# Altium schematic sheet SUPPORT.SchDoc: F2837x controlCARD
size 431 x 279 mm; Organization: Texas Instruments; Revision: 1.3
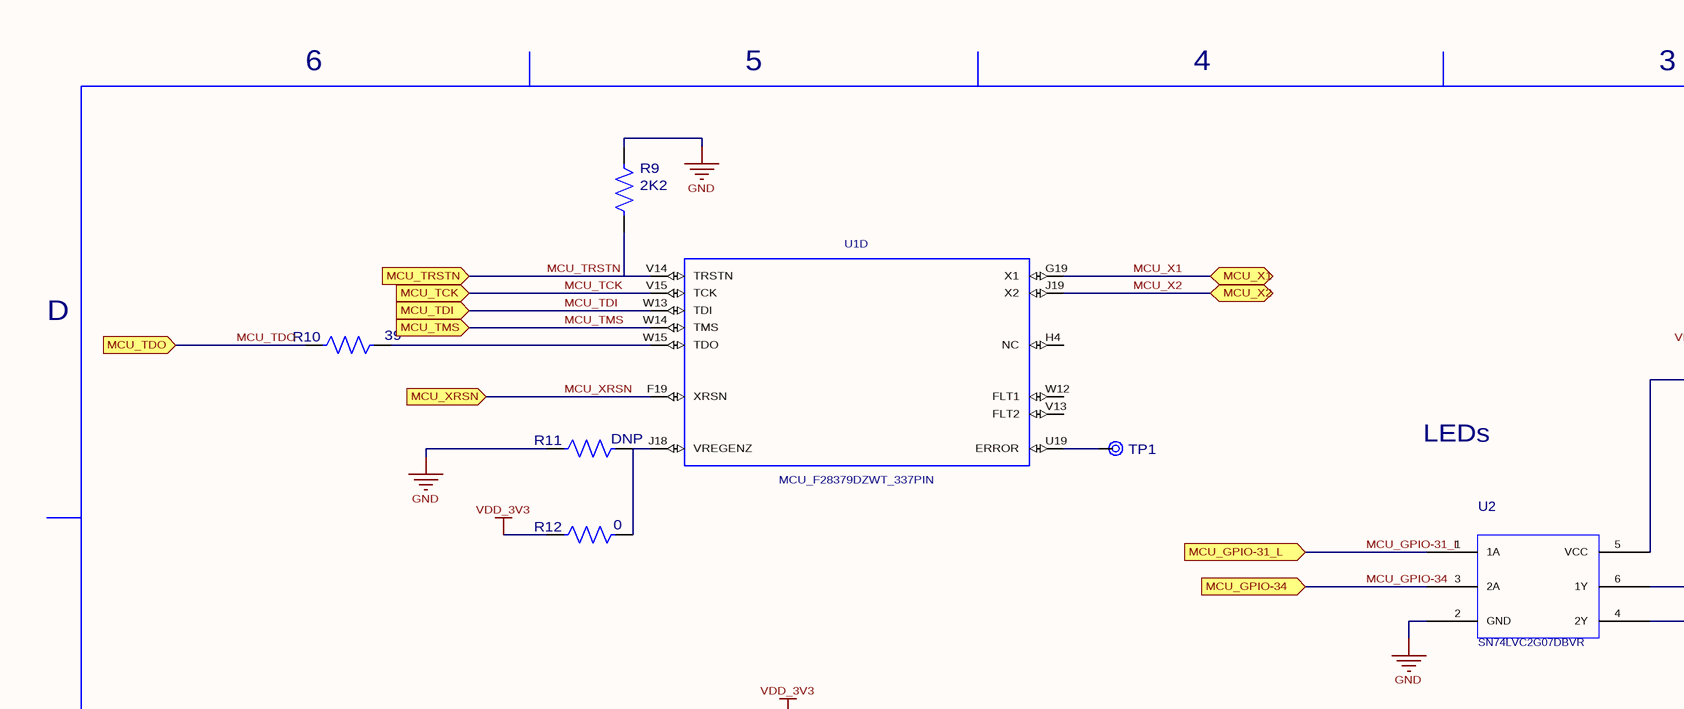
[diagram p0: SUPPORT.SchDoc, top left]
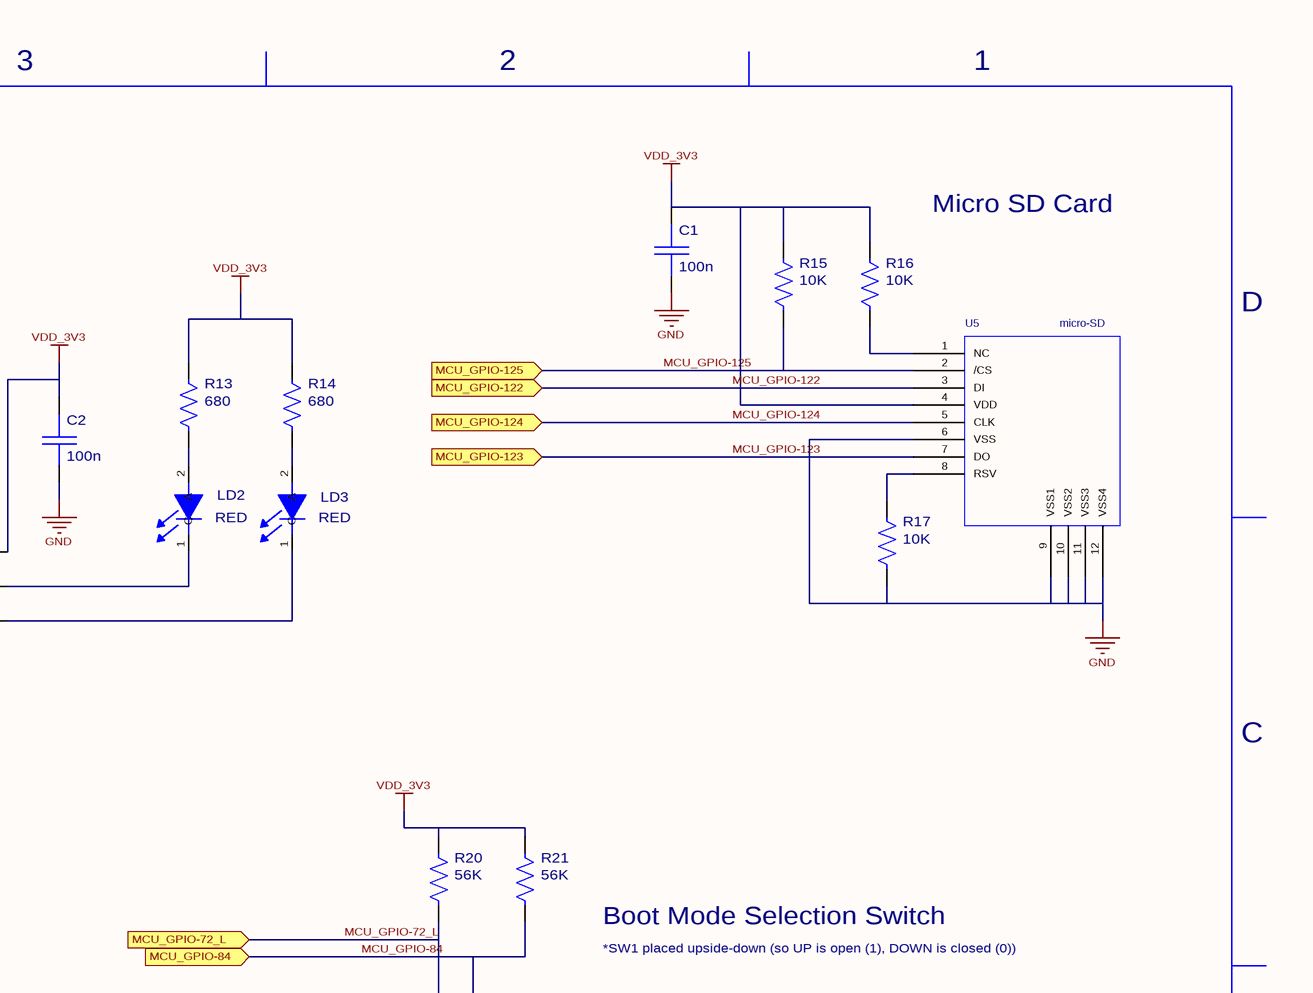
[diagram p1: SUPPORT.SchDoc, top right]
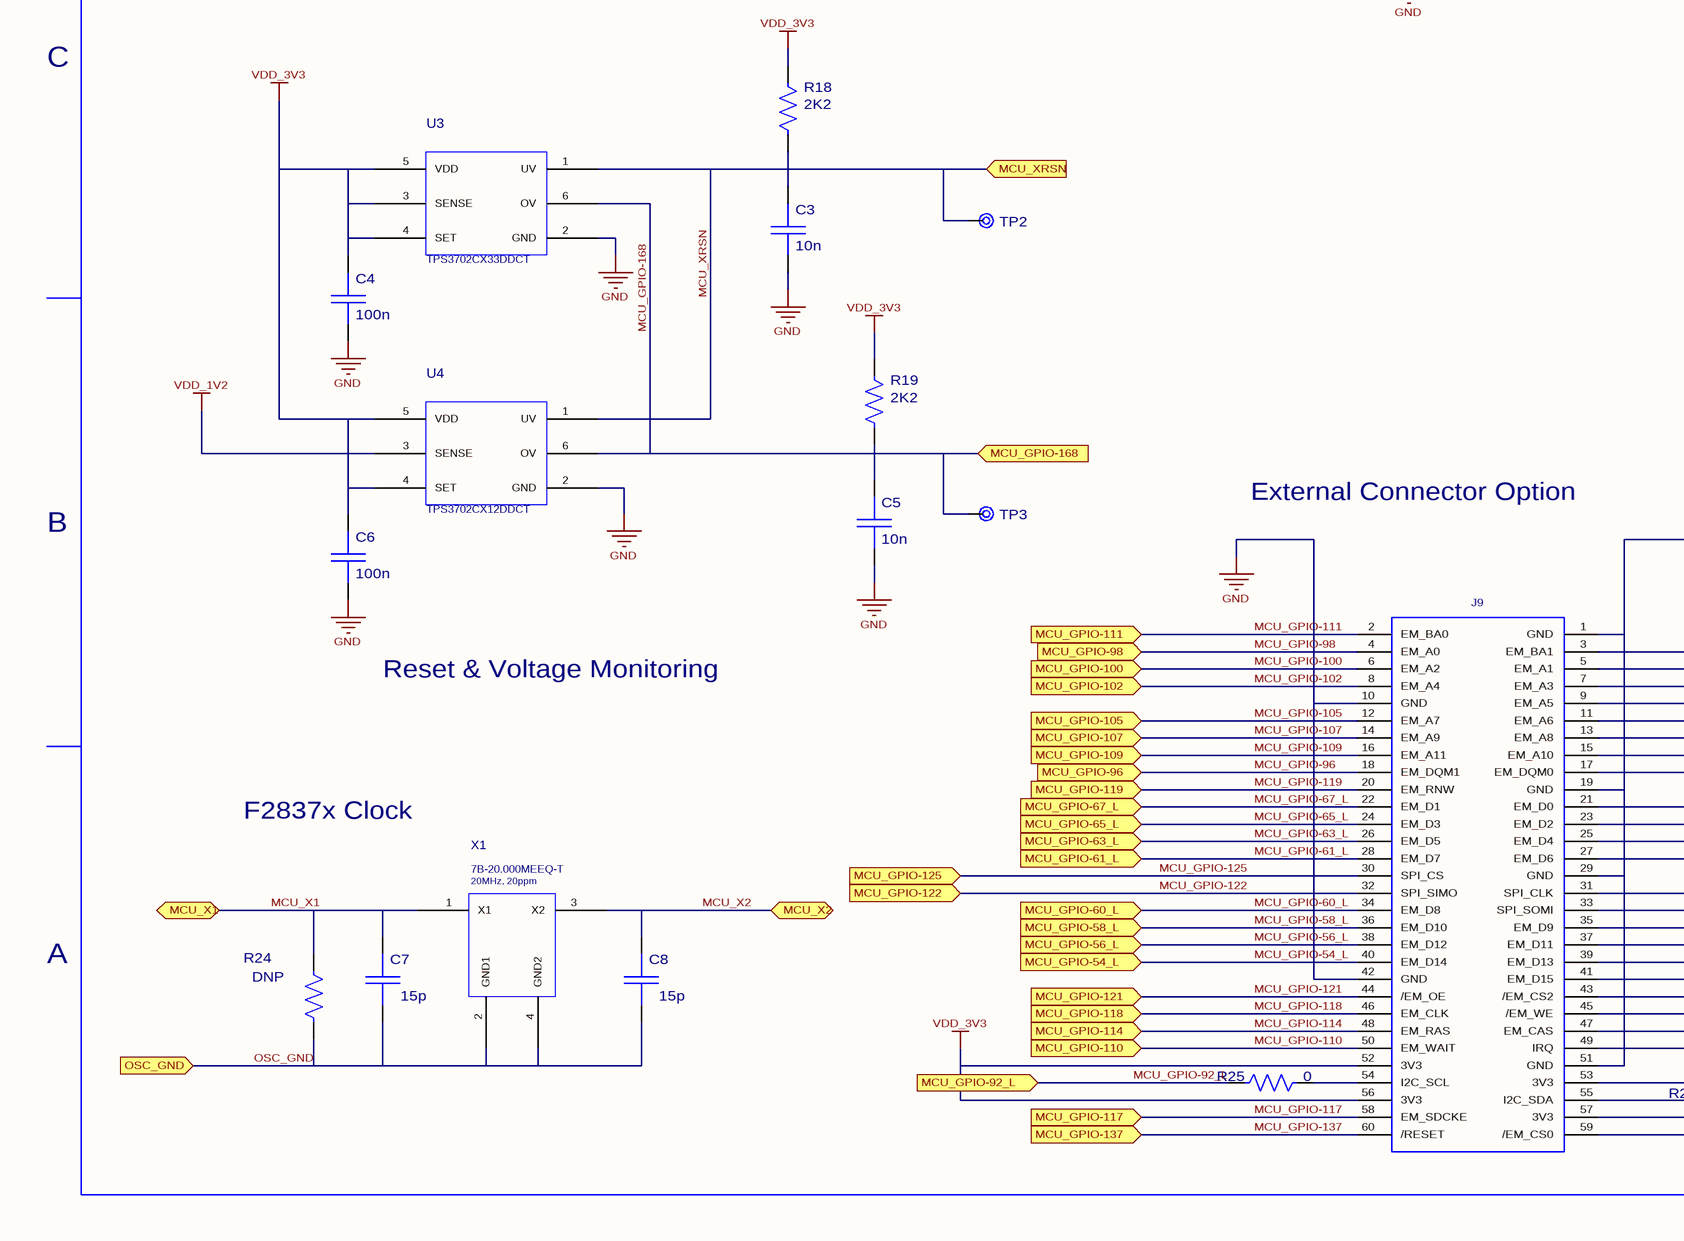
[diagram p2: SUPPORT.SchDoc, bottom left]
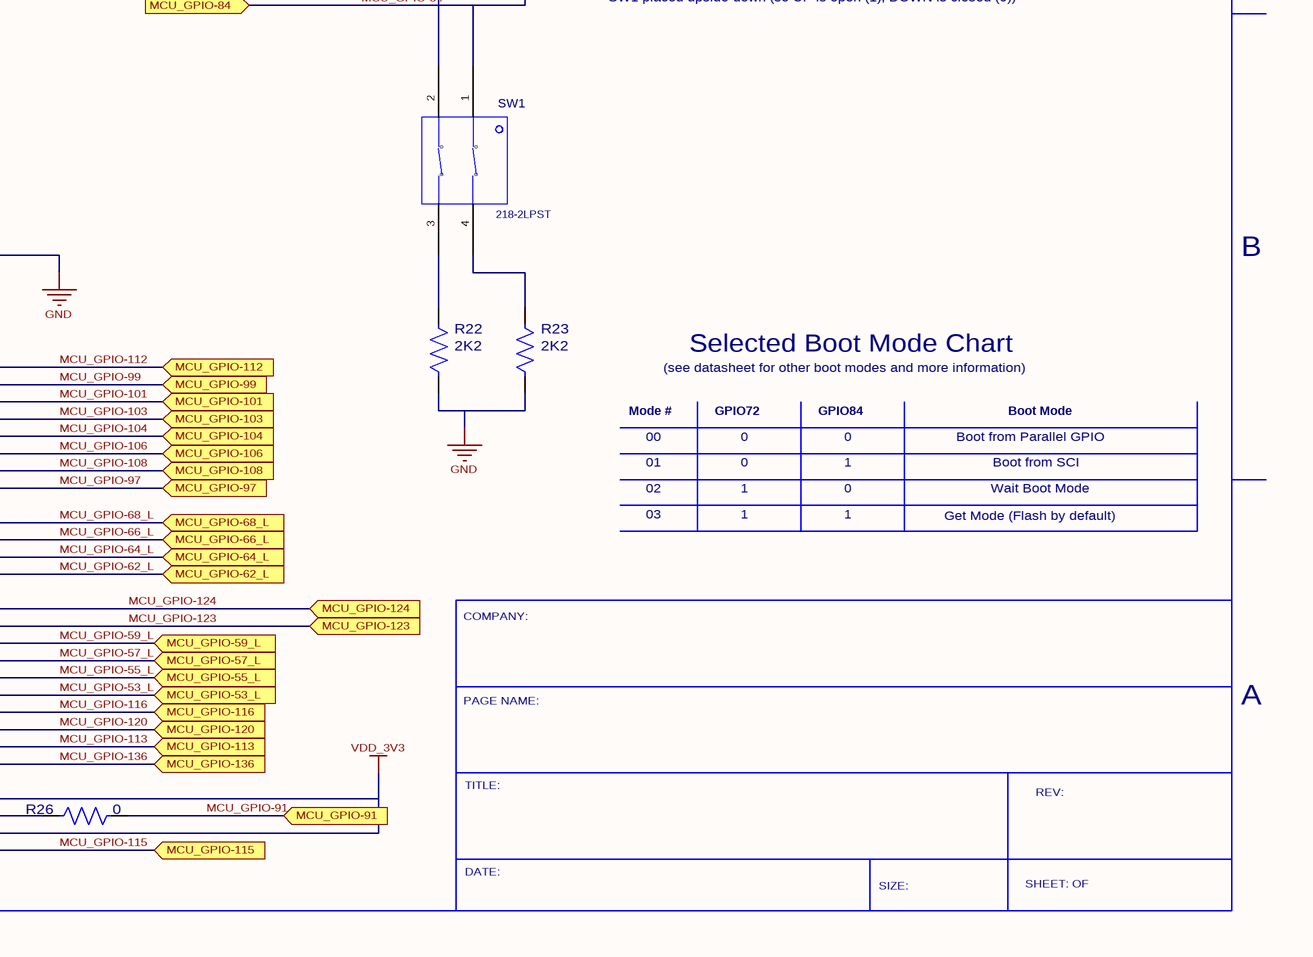
[diagram p3: SUPPORT.SchDoc, bottom right]

## Parts
C1  value 100n  [C0402]  (hidden comment: C0402_16V_X7R)
C2  value 100n  [C0402]  (hidden comment: C0402_16V_X7R)
C3  value 10n  [C0402]  (hidden comment: C0402_16V_X7R)
C4  value 100n  [C0402]  (hidden comment: C0402_16V_X7R)
C5  value 10n  [C0402]  (hidden comment: C0402_16V_X7R)
C6  value 100n  [C0402]  (hidden comment: C0402_16V_X7R)
C7  value 15p  [C0402]  (hidden comment: C0402_50V_NP0)
C8  value 15p  [C0402]  (hidden comment: C0402_50V_NP0)
J9  CONN_DF40C_CCARDIF_EMIFANDSPI  [DF40C-60DP-0.4V]  (value not drawn)
LD2  value RED  [LED0805]  (hidden comment: LED0805_RED)
LD3  value RED  [LED0805]  (hidden comment: LED0805_RED)
R9  value 2K2  [R0402]  (hidden comment: R0402_5%)
R10  value 39  [R0402]  (hidden comment: R0402_5%)
R11  value DNP  [R0402]  (hidden comment: R0402_5%)
R12  value 0  [R0402]  (hidden comment: R0402_5%)
R13  value 680  [R0402]  (hidden comment: R0402_5%)
R14  value 680  [R0402]  (hidden comment: R0402_5%)
R15  value 10K  [R0402]  (hidden comment: R0402_5%)
R16  value 10K  [R0402]  (hidden comment: R0402_5%)
R17  value 10K  [R0402]  (hidden comment: R0402_5%)
R18  value 2K2  [R0402]  (hidden comment: R0402_5%)
R19  value 2K2  [R0603]  (hidden comment: R0603_1%)
R20  value 56K  [R0402]  (hidden comment: R0402_5%)
R21  value 56K  [R0402]  (hidden comment: R0402_5%)
R22  value 2K2  [R0402]  (hidden comment: R0402_5%)
R23  value 2K2  [R0402]  (hidden comment: R0402_5%)
R24  value DNP  [R0402]  (hidden comment: R0402_5%)
R25  value 0  [R0402]  (hidden comment: R0402_5%)
R26  value 0  [R0402]  (hidden comment: R0402_5%)
SW1  value 218-2LPST  [SW_2POS_CTS218]  (hidden comment: SWITCH_2XSPST_SMT)
TP1  VIA_20_40  [VIA_20_40]  (value not drawn)
TP2  VIA_20_40  [VIA_20_40]  (value not drawn)
TP3  VIA_20_40  [VIA_20_40]  (value not drawn)
U1  MCU_F28379DZWT_337PIN  [TI_ZWT_337BGA]  (part D of 5)
U2  value SN74LVC2G07DBVR  [SOT-23-6]  (hidden comment: IC_LOGIC_SN74LVC2G07DBV)
U3  value TPS3702CX33DDCT  [SOT-23-6]  (hidden comment: IC_SVS_TPS3702CX33DDC)
U4  value TPS3702CX12DDCT  [SOT-23-6]  (hidden comment: IC_SVS_TPS3702CX12DDC)
U5  value micro-SD  [CONN_SDMICRO-3M-2900]  (hidden comment: CONN_MICROSD_2908-05WB-MG)
X1  value 20MHz, 20ppm  Part Number: 7B-20.000MEEQ-T  [XTAL_TXC_7B]  (hidden comment: XTAL_7B-20.000MEEQ-T)

## Ports
MCU_GPIO-31_L, MCU_GPIO-34, MCU_GPIO-53_L, MCU_GPIO-54_L, MCU_GPIO-55_L, MCU_GPIO-56_L, MCU_GPIO-57_L, MCU_GPIO-58_L, MCU_GPIO-59_L, MCU_GPIO-60_L, MCU_GPIO-61_L, MCU_GPIO-62_L, MCU_GPIO-63_L, MCU_GPIO-64_L, MCU_GPIO-65_L, MCU_GPIO-66_L, MCU_GPIO-67_L, MCU_GPIO-68_L, MCU_GPIO-72_L, MCU_GPIO-84, MCU_GPIO-91, MCU_GPIO-92_L, MCU_GPIO-96, MCU_GPIO-97, MCU_GPIO-98, MCU_GPIO-99, MCU_GPIO-100, MCU_GPIO-101, MCU_GPIO-102, MCU_GPIO-103, MCU_GPIO-104, MCU_GPIO-105, MCU_GPIO-106, MCU_GPIO-107, MCU_GPIO-108, MCU_GPIO-109, MCU_GPIO-110, MCU_GPIO-111, MCU_GPIO-112, MCU_GPIO-113, MCU_GPIO-114, MCU_GPIO-115, MCU_GPIO-116, MCU_GPIO-117, MCU_GPIO-118, MCU_GPIO-119, MCU_GPIO-120, MCU_GPIO-121, MCU_GPIO-122, MCU_GPIO-123, MCU_GPIO-124, MCU_GPIO-125, MCU_GPIO-136, MCU_GPIO-137, MCU_GPIO-168, MCU_TCK, MCU_TDI, MCU_TDO, MCU_TMS, MCU_TRSTN, MCU_X1 (bidir), MCU_X2 (bidir), MCU_XRSN, OSC_GND

## Nets
GND: C1.1 C2.1 C3.1 C4.1 C5.1 C6.1 J9.1(GND) J9.10(GND) J9.19(GND) J9.29(GND) J9.42(GND) J9.51(GND) R9.1 R11.1 R17.2 R22.2 R23.2 U2.2(GND) U3.2(GND) U4.2(GND) U5.6(VSS) U5.9(VSS1) U5.10(VSS2) U5.11(VSS3) U5.12(VSS4)
VDD_1V2: U4.3(SENSE)
VDD_3V3: C1.2 C2.2 C4.2 C6.2 J9.52(3V3) J9.53(3V3) J9.56(3V3) J9.57(3V3) R12.1 R13.1 R14.1 R15.1 R16.1 R18.1 R19.1 R20.1 R21.1 U2.5(VCC) U3.3(SENSE) U3.4(SET) U3.5(VDD) U4.4(SET) U4.5(VDD) U5.4(VDD)
MCU_GPIO-31_L: U2.1(1A) ; port MCU_GPIO-31_L
MCU_GPIO-34: U2.3(2A) ; port MCU_GPIO-34
MCU_GPIO-53_L: J9.41(EM_D15) ; port MCU_GPIO-53_L
MCU_GPIO-54_L: J9.40(EM_D14) ; port MCU_GPIO-54_L
MCU_GPIO-55_L: J9.39(EM_D13) ; port MCU_GPIO-55_L
MCU_GPIO-56_L: J9.38(EM_D12) ; port MCU_GPIO-56_L
MCU_GPIO-57_L: J9.37(EM_D11) ; port MCU_GPIO-57_L
MCU_GPIO-58_L: J9.36(EM_D10) ; port MCU_GPIO-58_L
MCU_GPIO-59_L: J9.35(EM_D9) ; port MCU_GPIO-59_L
MCU_GPIO-60_L: J9.34(EM_D8) ; port MCU_GPIO-60_L
MCU_GPIO-61_L: J9.28(EM_D7) ; port MCU_GPIO-61_L
MCU_GPIO-62_L: J9.27(EM_D6) ; port MCU_GPIO-62_L
MCU_GPIO-63_L: J9.26(EM_D5) ; port MCU_GPIO-63_L
MCU_GPIO-64_L: J9.25(EM_D4) ; port MCU_GPIO-64_L
MCU_GPIO-65_L: J9.24(EM_D3) ; port MCU_GPIO-65_L
MCU_GPIO-66_L: J9.23(EM_D2) ; port MCU_GPIO-66_L
MCU_GPIO-67_L: J9.22(EM_D1) ; port MCU_GPIO-67_L
MCU_GPIO-68_L: J9.21(EM_D0) ; port MCU_GPIO-68_L
MCU_GPIO-72_L: R20.2 SW1.2(B_OUT2) ; port MCU_GPIO-72_L
MCU_GPIO-84: R21.2 SW1.1(A_OUT1) ; port MCU_GPIO-84
MCU_GPIO-91: R26.2 ; port MCU_GPIO-91
MCU_GPIO-92_L: R25.1 ; port MCU_GPIO-92_L
MCU_GPIO-96: J9.18(EM_DQM1) ; port MCU_GPIO-96
MCU_GPIO-97: J9.17(EM_DQM0) ; port MCU_GPIO-97
MCU_GPIO-98: J9.4(EM_A0) ; port MCU_GPIO-98
MCU_GPIO-99: J9.5(EM_A1) ; port MCU_GPIO-99
MCU_GPIO-100: J9.6(EM_A2) ; port MCU_GPIO-100
MCU_GPIO-101: J9.7(EM_A3) ; port MCU_GPIO-101
MCU_GPIO-102: J9.8(EM_A4) ; port MCU_GPIO-102
MCU_GPIO-103: J9.9(EM_A5) ; port MCU_GPIO-103
MCU_GPIO-104: J9.11(EM_A6) ; port MCU_GPIO-104
MCU_GPIO-105: J9.12(EM_A7) ; port MCU_GPIO-105
MCU_GPIO-106: J9.13(EM_A8) ; port MCU_GPIO-106
MCU_GPIO-107: J9.14(EM_A9) ; port MCU_GPIO-107
MCU_GPIO-108: J9.15(EM_A10) ; port MCU_GPIO-108
MCU_GPIO-109: J9.16(EM_A11) ; port MCU_GPIO-109
MCU_GPIO-110: J9.50(EM_WAIT) ; port MCU_GPIO-110
MCU_GPIO-111: J9.2(EM_BA0) ; port MCU_GPIO-111
MCU_GPIO-112: J9.3(EM_BA1) ; port MCU_GPIO-112
MCU_GPIO-113: J9.47(EM_CAS) ; port MCU_GPIO-113
MCU_GPIO-114: J9.48(EM_RAS) ; port MCU_GPIO-114
MCU_GPIO-115: J9.59(/EM_CS0) ; port MCU_GPIO-115
MCU_GPIO-116: J9.43(/EM_CS2) ; port MCU_GPIO-116
MCU_GPIO-117: J9.58(EM_SDCKE) ; port MCU_GPIO-117
MCU_GPIO-118: J9.46(EM_CLK) ; port MCU_GPIO-118
MCU_GPIO-119: J9.20(EM_RNW) ; port MCU_GPIO-119
MCU_GPIO-120: J9.45(/EM_WE) ; port MCU_GPIO-120
MCU_GPIO-121: J9.44(/EM_OE) ; port MCU_GPIO-121
MCU_GPIO-122: J9.32(SPI_SIMO) U5.3(DI) ; port MCU_GPIO-122
MCU_GPIO-123: J9.33(SPI_SOMI) U5.7(DO) ; port MCU_GPIO-123
MCU_GPIO-124: J9.31(SPI_CLK) U5.5(CLK) ; port MCU_GPIO-124
MCU_GPIO-125: J9.30(SPI_CS) R15.2 U5.2(/CS) ; port MCU_GPIO-125
MCU_GPIO-136: J9.49(IRQ) ; port MCU_GPIO-136
MCU_GPIO-137: J9.60(/RESET) ; port MCU_GPIO-137
MCU_GPIO-168: C5.2 R19.2 TP3.1 U3.6(OV) U4.6(OV) ; port MCU_GPIO-168
MCU_TCK: U1.V15(TCK) ; port MCU_TCK
MCU_TDI: U1.W13(TDI) ; port MCU_TDI
MCU_TDO: R10.1 ; port MCU_TDO
MCU_TMS: U1.W14(TMS) ; port MCU_TMS
MCU_TRSTN: R9.2 U1.V14(TRSTN) ; port MCU_TRSTN
MCU_X1: C7.2 R24.1 U1.G19(X1) X1.1(X1) ; port MCU_X1
MCU_X2: C8.2 U1.J19(X2) X1.3(X2) ; port MCU_X2
MCU_XRSN: C3.2 R18.2 TP2.1 U1.F19(XRSN) U3.1(UV) U4.1(UV) ; port MCU_XRSN
OSC_GND: C7.1 C8.1 R24.2 X1.2(GND1) X1.4(GND2) ; port OSC_GND
NetJ9_54: J9.54(I2C_SCL) R25.2
NetJ9_55: J9.55(I2C_SDA) R26.1
NetLD2_1: LD2.1(C) U2.6(1Y)
NetLD2_2: LD2.2(A) R13.2
NetLD3_1: LD3.1(C) U2.4(2Y)
NetLD3_2: LD3.2(A) R14.2
NetR10_2: R10.2 U1.W15(TDO)
NetR11_2: R11.2 R12.2 U1.J18(VREGENZ)
NetR16_2: R16.2 U5.1(NC)
NetR17_1: R17.1 U5.8(RSV)
NetR22_1: R22.1 SW1.3(B_IN1)
NetR23_1: R23.1 SW1.4(A_IN1)
NetTP1_1: TP1.1 U1.U19(ERROR)

Not connected (* = marked no-connect by the designer): U1 H4(NC) V13(FLT2) W12(FLT1)

## Notes on the sheet
- 6
- 5
- 4
- 3
- 2
- 1
- Micro SD Card
- D
- LEDs
- C
- *SW1 placed upside-down (so UP is open (1), DOWN is closed (0))
- Boot Mode Selection Switch
- External Connector Option
- B
- Reset & Voltage Monitoring
- (see datasheet for other boot modes and more information)
- Selected Boot Mode Chart
- Mode #
- 01
- 00
- GPIO72
- 0
- GPIO84
- Boot from Parallel GPIO
- Boot from SCI
- Boot Mode
- F2837x Clock
- 03
- 02
- Get Mode (Flash by default)
- Wait Boot Mode
- COMPANY:
- A
- PAGE NAME:
- TITLE:
- REV:
- DATE:
- SIZE:
- SHEET: OF
- (in symbol SWITCH_2XSPST_SMT) o

## Library data of the parts
C1-C6 = C0402_16V_X7R: CAP CER 16V 10% X7R 0402; Decal: C0402; PCB DECAL: C0402
C7 C8 = C0402_50V_NP0: CAP CER 50V NP0 0402; Decal: C0402; PCB DECAL: C0402
J9 = CONN_DF40C_CCARDIF_EMIFANDSPI: 60pin connector - SMT, Hirose DF40C-60DP-0.4V(51); Decal: DF40C-60DP-0.4V; Digikey: H11628CT-ND; Manufacturer: Hirose; Part Number: DF40C-60DP-0.4V(51); PCB DECAL: DF40C-60DP-0.4V
LD2 LD3 = LED0805_RED: LED RED 0805 SMD, Diffused, 647nm; Decal: LED0805; PCB DECAL: LED0805
R9-R18 R20-R26 = R0402_5%: RES 1/16W 5% 0402 SMD; Decal: R0402; PCB DECAL: R0402
R19 = R0603_1%: RES 1/10W 1% 0603 SMD; Decal: R0603; PCB DECAL: R0603
SW1 = SWITCH_2XSPST_SMT: 2xSPST DIP switch SMT, half-pitch; Manufacturer: CTS Electrocomponents; Decal: SW_2POS_CTS218; Digikey: CT2182LPST-ND; Part Number: 218-2LPST; Size: 3.71 L x 8.89 W, 1.27 LS (mm); Height: 2.65 (mm); PCB DECAL: SW_2POS_CTS218
TP1-TP3 = VIA_20_40: Via, 20 ID, 40 OD (mil); Decal: VIA_20_40; Size: 20 ID, 40 OD (mil); PCB DECAL: VIA_20_40
U1 = MCU_F28379DZWT_337PIN: MCU F2837x 337pin ZWT BGA; Part Number: TMS320F28379DZWT; Decal: TI_ZWT_337BGA; PCB DECAL: TI_ZWT_337BGA
U2 = IC_LOGIC_SN74LVC2G07DBV: Buffer Line Driver, non-inverting, 32mA; Manufacturer: Texas Instruments; PCB DECAL: SOT-23-6; Decal: SOT-23-6; Digikey: 296-13494-1-ND; Part Number: SN74LVC2G07DBVR
U3 = IC_SVS_TPS3702CX33DDC: Volage Monitor, 3.3V, 5% or 10%; Manufacturer: Texas Instruments; Decal: SOT-23-6; Digikey: 296-39651-1-ND; Part Number: TPS3702CX33DDCT; PCB DECAL: SOT-23-6
U4 = IC_SVS_TPS3702CX12DDC: Volage Monitor, 1.2V, 5% or 10%; Manufacturer: Texas Instruments; Decal: SOT-23-6; Digikey: 296-42074-1-ND; Part Number: TPS3702CX12DDCT; PCB DECAL: SOT-23-6
U5 = CONN_MICROSD_2908-05WB-MG: micro SD Connector+Ejector, 10 (8+2) positions, SMT-top; Manufacturer: 3M; Decal: CONN_SDMICRO-3M-2900; Digikey: 3M5607CT-ND; Height: 1.85 (mm); Part Number: 2908-05WB-MG; PCB DECAL: CONN_SDMICRO-3M-2900
X1 = XTAL_7B-20.000MEEQ-T: 20MHz Crystal, 20ppm; Manufacturer: TXC Corporation; Decal: XTAL_TXC_7B; Digikey: 887-1303-1-ND; Height: 1.05 (mm); Size: 5 L x 3.2 W (mm); PCB DECAL: XTAL_TXC_7B